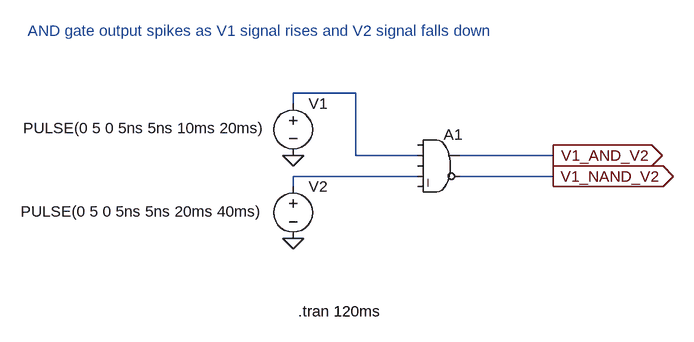
[diagram p0: schematic v1_and_nand_v2.asc]
v1_and_nand_v2.asc, the LTspice schematic file:
Version 4
SHEET 1 880 680
WIRE 160 32 64 32
WIRE 64 48 64 32
WIRE 160 128 160 32
WIRE 256 128 160 128
WIRE 464 128 320 128
WIRE 256 160 64 160
WIRE 464 160 320 160
WIRE 64 176 64 160
FLAG 64 128 0
FLAG 64 256 0
FLAG 464 128 V1_AND_V2
IOPIN 464 128 Out
FLAG 464 160 V1_NAND_V2
IOPIN 464 160 Out
SYMBOL voltage 64 32 R0
WINDOW 3 -415 54 Left 2
WINDOW 123 0 0 Left 0
WINDOW 39 0 0 Left 0
SYMATTR InstName V1
SYMATTR Value PULSE(0 5 0 5ns 5ns 10ms 20ms)
SYMBOL voltage 64 160 R0
WINDOW 3 -419 54 Left 2
WINDOW 123 0 0 Left 0
WINDOW 39 0 0 Left 0
SYMATTR InstName V2
SYMATTR Value PULSE(0 5 0 5ns 5ns 20ms 40ms)
SYMBOL Digital\\and 288 80 R0
SYMATTR InstName A1
TEXT 72 368 Left 2 !.tran 120ms
TEXT -344 -64 Left 2 ;AND gate output spikes as V1 signal rises and V2 signal falls down

The netlist it stands for:
* v1_and_nand_v2.asc
V1 N001 0 PULSE(0 5 0 5ns 5ns 10ms 20ms)
V2 N002 0 PULSE(0 5 0 5ns 5ns 20ms 40ms)
A1 0 N001 0 N002 0 V1_NAND_V2 V1_AND_V2 0 AND
.tran 120ms
* AND gate output spikes as V1 signal rises and V2 signal falls down
.backanno
.end